# Altium schematic sheet Emitter.SchDoc: Emitter Board
size A4; DrawnBy: 1942994; Engineer: 1942994; Organization: WMG; Address1: University of Warwick; Address2: WM355; DocumentNumber: 1; Revision: 1; SheetNumber: 1; SheetTotal: 1
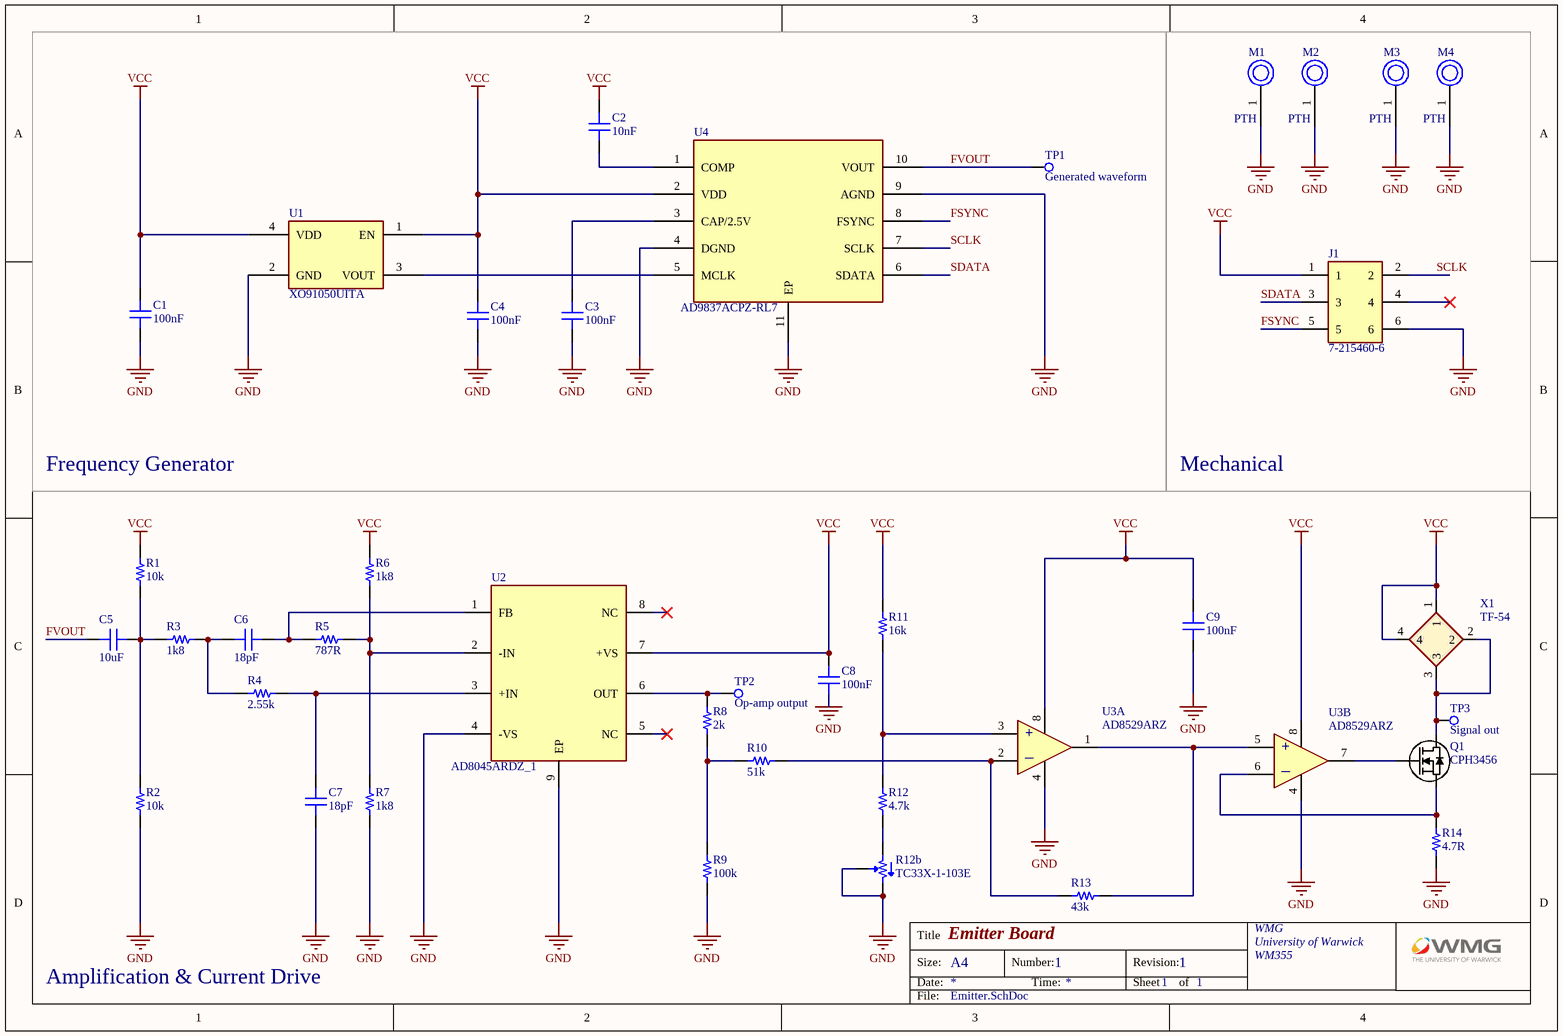
[diagram p0: Emitter.SchDoc]

## Parts
C1  100nF  [CAP 0603_1608]
C2  10nF  [CAP 0603_1608]
C3  100nF  [CAP 0603_1608]
C4  100nF  [CAP 0603_1608]
C5  10uF  [CAP 0603_1608]
C6  18pF  [CAP 0603_1608]
C7  18pF  [CAP 0603_1608]
C8  100nF  [CAP 0603_1608]
C9  100nF  [CAP 0603_1608]
J1  7-215460-6  [72154606]
M1  PTH  [M2-PTH]
M2  PTH  [M2-PTH]
M3  PTH  [M2-PTH]
M4  PTH  [M2-PTH]
Q1  CPH3456  [CPH3456]
R1  10k  [RES 0603_1608]
R2  10k  [RES 0603_1608]
R3  1k8  [RES 0603_1608]
R4  2.55k  [RES 0603_1608]
R5  787R  [RES 0603_1608]
R6  1k8  [RES 0603_1608]
R7  1k8  [RES 0603_1608]
R8  2k  [RES 0603_1608]
R9  100k  [RES 0603_1608]
R10  51k  [RES 0603_1608]
R11  16k  [RES 0603_1608]
R12  4.7k  [RES 0603_1608]
R12b  TC33X-1-103E  [TC33X2201E]
R13  43k  [RES 0603_1608]
R14  4.7R  [RES 0805_2012]
TP1  Generated waveform  [TP-SMD-50mil]
TP2  Op-amp output  [TP-SMD-50mil]
TP3  Signal out  [TP-SMD-50mil]
U1  XO91050UITA  [XO91050UITA24576]
U2  AD8045ARDZ_1  [SOIC127P600X175-9N]
U3  AD8529ARZ  [AD8529ARZ]  (parts A,B of 2)
U4  AD9837ACPZ-RL7  [AD9837ACPZ-RL7]
X1  TF-54  [TF-54]

## Blocks framed on the sheet
Frequency Generator: C1-C4 TP1 U1 U4
Mechanical: J1 M1-M4

## Nets
GND: C1.1 C3.1 C4.1 C7.1 C8.1 C9.1 J1.6 M1.1 M2.1 M3.1 M4.1 R2.1 R7.1 R9.1 R12b.2(WIPER) R12b.3(CW) R14.1 U1.2(GND) U2.4(-VS) U2.9(EP) U3.4(V-) U4.4(DGND) U4.9(AGND) U4.11(EP)
VCC: C1.2 C2.2 C4.2 C8.2 C9.2 J1.1 R1.2 R6.2 R11.2 U1.1(EN) U1.4(VDD) U2.7(+VS) U3.8(V+) U4.2(VDD) X1.1 X1.4
FSYNC: J1.5 U4.8(FSYNC)
FVOUT: C5.1 TP1.1(TP) U4.10(VOUT)
SCLK: J1.2 U4.7(SCLK)
SDATA: J1.3 U4.6(SDATA)
NetC2_1: C2.1 U4.1(COMP)
NetC3_2: C3.2 U4.3(CAP/2.5V)
NetC5_2: C5.2 R1.1 R2.2 R3.1
NetC6_1: C6.1 R3.2 R4.1
NetC6_2: C6.2 R5.1 U2.1(FB)
NetC7_2: C7.2 R4.2 U2.3(+IN)
NetQ1_1: Q1.1(G) U3.7(OUT_B)
NetQ1_2: Q1.2(D) TP3.1(TP) X1.2 X1.3
NetQ1_3: Q1.3(S) R14.2 U3.6(-IN_B)
NetR5_2: R5.2 R6.1 R7.2 U2.2(-IN)
NetR8_1: R8.1 R9.2 R10.1
NetR8_2: R8.2 TP2.1(TP) U2.6(OUT)
NetR10_2: R10.2 R13.1 U3.2(-IN_A)
NetR11_1: R11.1 R12.2 U3.3(+IN_A)
NetR12_1: R12.1 R12b.1(CCW)
NetR13_2: R13.2 U3.1(OUT_A) U3.5(+IN_B)
NetU1_3: U1.3(VOUT) U4.5(MCLK)

Not connected (* = marked no-connect by the designer): J1 4*; U2 5(NC)* 8(NC)*

## Notes on the sheet
- Amplification & Current Drive
- Title
- Size:
- Date:
- A4
- Number:
- Time:
- Revision:
- Sheet
- of
- File:
- (in symbol AD8529ARZ, part A) +; _
- (in symbol AD8529ARZ, part B) +; _

## Library data of the parts
C1-C9 = Capacitor: SMT Capacitor
  C1 C3 C4 C8 C9: VALUE: 100nF
  C2: VALUE: 10nF
  C5: VALUE: 10uF
  C6 C7: VALUE: 18pF
J1 = 7-215460-6: Micro-Match Connector Female 6-Way; Manufacturer_Name: TE Connectivity; Datasheet Link: https://www.te.com/commerce/DocumentDelivery/DDEController?Action=srchrtrv&DocNm=4-1773457-1_050_Micro_MaTch&DocType=Data+Sheet&DocLang=English&PartCntxt=7-215460-6&DocFormat=pdf; Height: 6mm; Manufacturer_Part_Number: 7-215460-6; Mouser Part Number: 571-7-215460-6; Mouser Price/Stock: https://www.mouser.co.uk/ProductDetail/TE-Connectivity/7-215460-6/?qs=XAKIUOoRPe4W4KMZv%2FpWzg%3D%3D; Arrow Part Number: 7-215460-6; Arrow Price/Stock: https://www.arrow.com/en/products/7-215460-6/te-connectivity; System: Connector
M1-M4 = PTH: Mounting Hole (Plated, Exposed Pad)
Q1 = CPH3456: N channel MOSFET
R1-R14 = Resistor: SMT Resistor
  R1 R2: VALUE: 10k
  R3 R6 R7: VALUE: 1k8
  R4: VALUE: 2.55k
  R5: VALUE: 787R
  R8: VALUE: 2k
  R9: VALUE: 100k
  R10: VALUE: 51k
  R11: VALUE: 16k
  R12: VALUE: 4.7k
  R13: VALUE: 43k
  R14: VALUE: 4.7R
R12b = TC33X-1-103E: SMD Trim Potentiometer; Manufacturer_Name: Bourns; Datasheet Link: https://www.bourns.com/pdfs/TC33.pdf; Manufacturer_Part_Number: TC33X-1-103E; Mouser Part Number: 652-TC33X-1-103E; Mouser Price/Stock: https://www.mouser.co.uk/ProductDetail/Bourns/TC33X-1-103E?qs=4vvWAaIu%2Fq5rtw%252Bjip48Mw%3D%3D; Arrow Part Number: TC33X-1-103E; Arrow Price/Stock: https://www.arrow.com/en/products/tc33x-1-103e/bourns?region=nac
TP1-TP3 = Test Point
U1 = 16MHZ_XO91050UITA: 16 MHz SMD oscillator; Manufacturer_Name: EUROQUARTZ; Manufacturer_Part_Number: 14.7456MHZ XO91050UITA; Datasheet Link: http://www.farnell.com/datasheets/75391.pdf; Height: 1mm
U2 = AD8045ARDZ: High speed op-amp; Manufacturer_Name: Analog Devices; Datasheet Link: https://datasheet.datasheetarchive.com/originals/distributors/Datasheets-SFU1/DSASFU10003709.pdf; Height: 1.75mm; Manufacturer_Part_Number: AD8045ARDZ; Mouser Part Number: 584-AD8045ARDZ; Mouser Price/Stock: https://www.mouser.co.uk/ProductDetail/Analog-Devices/AD8045ARDZ?qs=%2FtpEQrCGXCwHFOdY8Jjrpw%3D%3D; Arrow Part Number: AD8045ARDZ; Arrow Price/Stock: https://www.arrow.com/en/products/ad8045ardz/analog-devices
U3 = AD8529ARZ: Op-amp
U4 = AD9837ACPZ-RL7: Programmable waveform generator
X1 = TF-54: TF-54 Socket from Fischer Elektronik